# Altium schematic sheet HDMI.SchDoc
size 594 x 420 mm
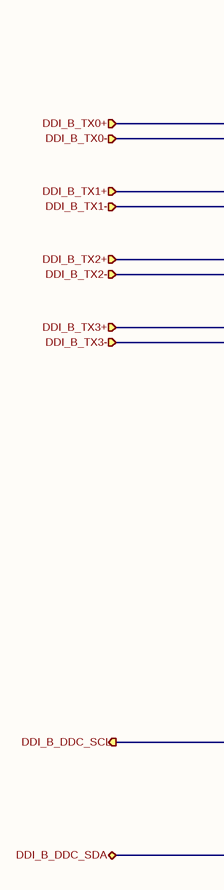
[diagram p0: HDMI.SchDoc, top left]
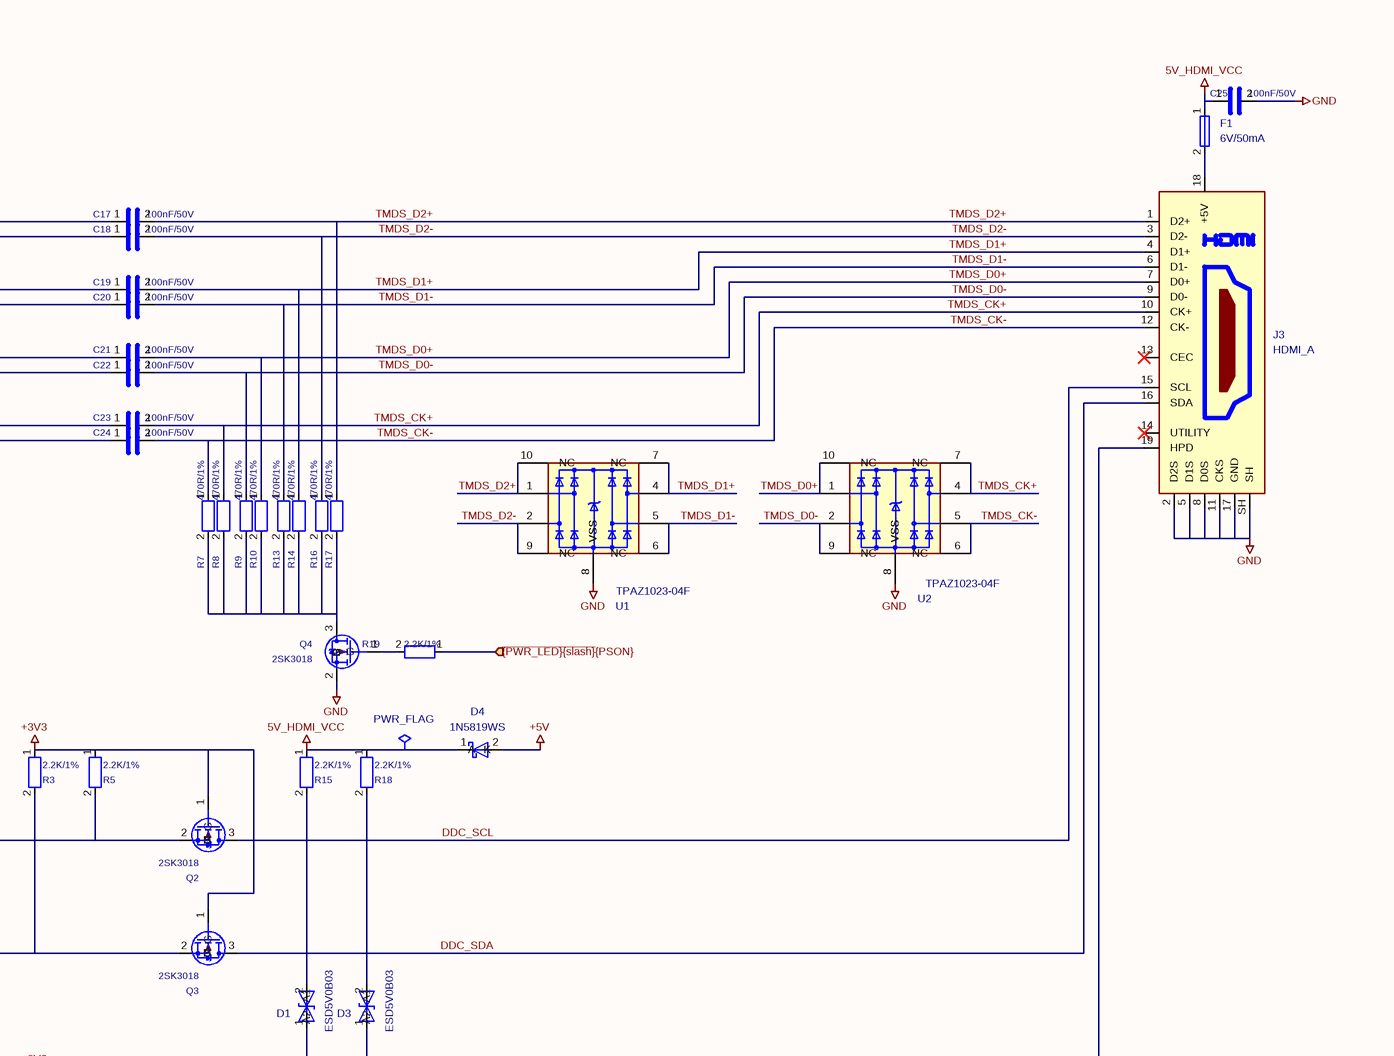
[diagram p1: HDMI.SchDoc, top right]
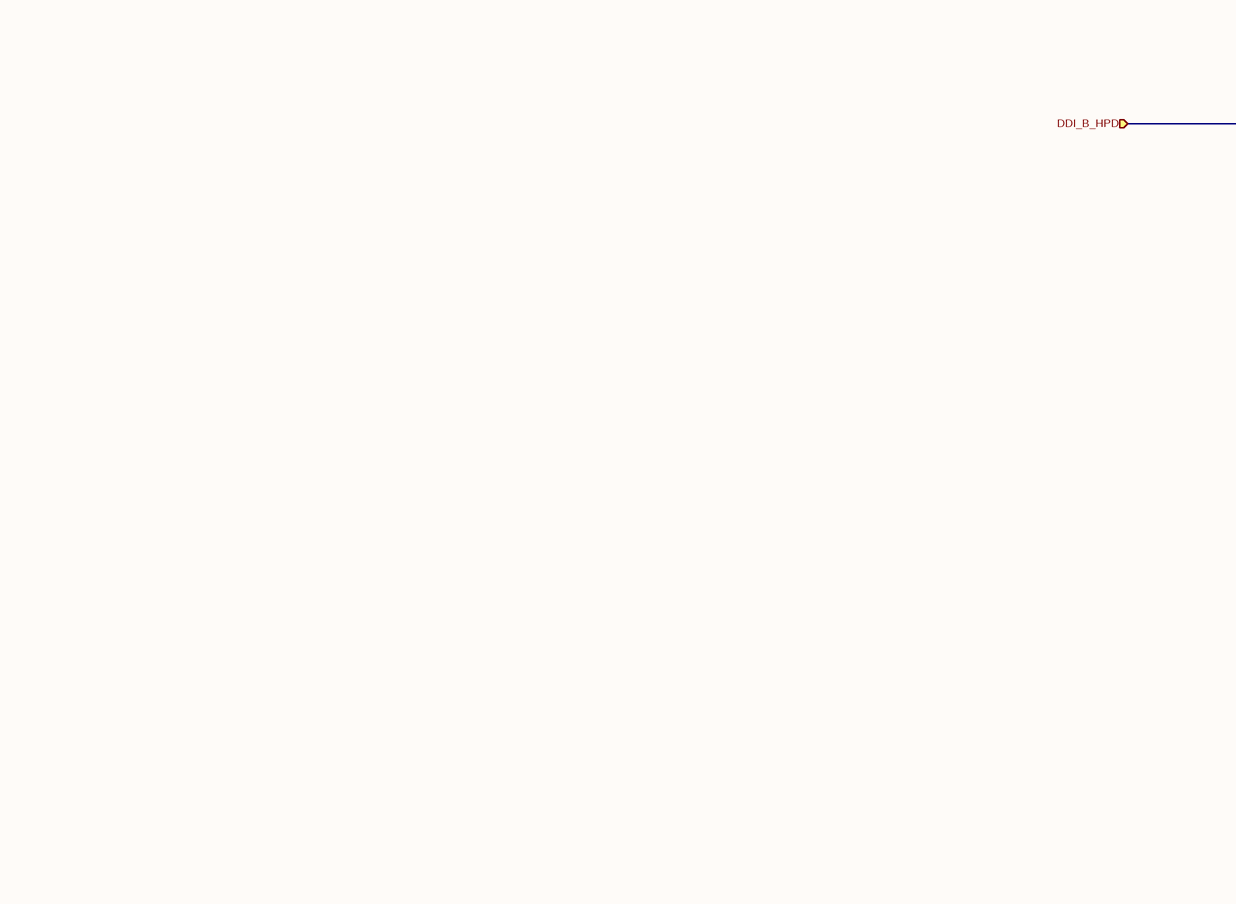
[diagram p2: HDMI.SchDoc, bottom left]
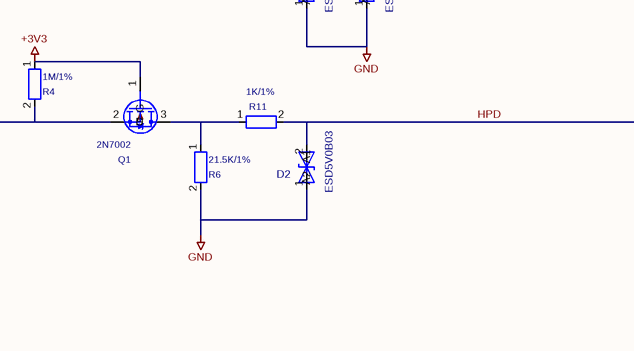
[diagram p3: HDMI.SchDoc, bottom right]

## Parts
#FLG0401  PWR_FLAG  (graphical)
C17  100nF/50V  [C_0402_1005Metric]
C18  100nF/50V  [C_0402_1005Metric]
C19  100nF/50V  [C_0402_1005Metric]
C20  100nF/50V  [C_0402_1005Metric]
C21  100nF/50V  [C_0402_1005Metric]
C22  100nF/50V  [C_0402_1005Metric]
C23  100nF/50V  [C_0402_1005Metric]
C24  100nF/50V  [C_0402_1005Metric]
C25  100nF/50V  [C_0402_1005Metric]
D1  ESD5V0B03  [D_0402_1005Metric]
D2  ESD5V0B03  [D_0402_1005Metric]
D3  ESD5V0B03  [D_0402_1005Metric]
D4  1N5819WS  [D_SOD-323]
F1  6V/50mA  [R_0603_1608Metric]
J3  HDMI_A  [HDMI_A_Molex_208658-1001_Horizontal]
Q1  2N7002  [SOT-23]
Q2  2SK3018  [SOT-23]
Q3  2SK3018  [SOT-23]
Q4  2SK3018  [SOT-23]
R3  2.2K/1%  [R_0402_1005Metric]
R4  1M/1%  [R_0402_1005Metric]
R5  2.2K/1%  [R_0402_1005Metric]
R6  21.5K/1%  [R_0402_1005Metric]
R7  470R/1%  [R_0402_1005Metric]
R8  470R/1%  [R_0402_1005Metric]
R9  470R/1%  [R_0402_1005Metric]
R10  470R/1%  [R_0402_1005Metric]
R11  1K/1%  [R_0402_1005Metric]
R13  470R/1%  [R_0402_1005Metric]
R14  470R/1%  [R_0402_1005Metric]
R15  2.2K/1%  [R_0402_1005Metric]
R16  470R/1%  [R_0402_1005Metric]
R17  470R/1%  [R_0402_1005Metric]
R18  2.2K/1%  [R_0402_1005Metric]
R19  2.2K/1%  [R_0402_1005Metric]
U1  TPAZ1023-04F  [Diodes_UDFN-10_1.0x2.5mm_P0.5mm]
U2  TPAZ1023-04F  [Diodes_UDFN-10_1.0x2.5mm_P0.5mm]

## Ports
DDI_B_DDC_SCL (out), DDI_B_DDC_SDA (bidir), DDI_B_HPD (in), DDI_B_TX0+ (in), DDI_B_TX0- (in), DDI_B_TX1+ (in), DDI_B_TX1- (in), DDI_B_TX2+ (in), DDI_B_TX2- (in), DDI_B_TX3+ (in), DDI_B_TX3- (in), ~{{PWR_LED}{slash}}{PSON} (in)

## Nets
5V_HDMI_VCC: #FLG0401.1 C25.1 D4.1(K) F1.1 R15.1 R18.1
+3V3: Q1.1(G) Q2.1(G) Q3.1(G) R3.1 R4.1 R5.1
+5V: D4.2(A)
GND: C25.2 D1.1(A1) D2.1(A1) D3.1(A1) J3.2(D2S) J3.5(D1S) J3.8(D0S) J3.11(CKS) J3.17(GND) J3.SH Q4.2(S) R6.2 U1.3(VSS) U1.8(VSS) U2.3(VSS) U2.8(VSS)
DDC_SCL: D1.2(A2) J3.15(SCL) Q2.3(D) R15.2
DDC_SDA: D3.2(A2) J3.16(SDA) Q3.3(D) R18.2
DDI_B_DDC_SCL: Q2.2(S) R5.2 ; port DDI_B_DDC_SCL
DDI_B_DDC_SDA: Q3.2(S) R3.2 ; port DDI_B_DDC_SDA
DDI_B_HPD: Q1.2(S) R4.2 ; port DDI_B_HPD
DDI_B_TX0+: C17.1 ; port DDI_B_TX0+
DDI_B_TX0-: C18.1 ; port DDI_B_TX0-
DDI_B_TX1+: C19.1 ; port DDI_B_TX1+
DDI_B_TX1-: C20.1 ; port DDI_B_TX1-
DDI_B_TX2+: C21.1 ; port DDI_B_TX2+
DDI_B_TX2-: C22.1 ; port DDI_B_TX2-
DDI_B_TX3+: C23.1 ; port DDI_B_TX3+
DDI_B_TX3-: C24.1 ; port DDI_B_TX3-
HPD: D2.2(A2) J3.19(HPD) R11.2
TMDS_CK+: C23.2 J3.10(CK+) R8.1 U2.4 U2.7(NC)
TMDS_CK-: C24.2 J3.12(CK-) R7.1 U2.5 U2.6(NC)
TMDS_D0+: C21.2 J3.7(D0+) R10.1 U2.1 U2.10(NC)
TMDS_D0-: C22.2 J3.9(D0-) R9.1 U2.2 U2.9(NC)
TMDS_D1+: C19.2 J3.4(D1+) R14.1 U1.4 U1.7(NC)
TMDS_D1-: C20.2 J3.6(D1-) R13.1 U1.5 U1.6(NC)
TMDS_D2+: C17.2 J3.1(D2+) R17.1 U1.1 U1.10(NC)
TMDS_D2-: C18.2 J3.3(D2-) R16.1 U1.2 U1.9(NC)
~{{PWR_LED}{slash}}{PSON}: R19.1 ; port ~{{PWR_LED}{slash}}{PSON}
NetF1_2: F1.2 J3.18(+5V)
NetQ1_3: Q1.3(D) R6.1 R11.1
NetQ4_1: Q4.1(G) R19.2
NetQ4_3: Q4.3(D) R7.2 R8.2 R9.2 R10.2 R13.2 R14.2 R16.2 R17.2

Not connected (* = marked no-connect by the designer): J3 13(CEC)* 14(UTILITY)*

## Notes on the sheet
- 1
- 2
- 3
- 4
- 5
- 6
- 7
- 8
- 9
- 10
- 11
- A
- B
- C
- D
- E
- F
- G
- H
- Title: Primer Carrier for LattePanda Mu
- File: HDMI.kicad_sch
- Sheet: /
- DFRobot
- KiCad E.D.A.  kicad (5.1.4)-1
- Size: A2
- Date: 2024-03-13
- Rev: V1.0.0
- Id: 1/1

## Library data of the parts
#FLG0401 = PWR_FLAG: Description: Special symbol for telling ERC where power comes from; Value: PWR_FLAG
C17-C25 = C: SCH_Show_Footprint: C0402; Value: 100nF/50V; Footprint: A_HDJ_Library:C_0402_1005Metric
D1-D3 = ESD9B5.0ST5G: SCH_Show_Footprint: D0402; Value: ESD5V0B03; Footprint: A_HDJ_Library:D_0402_1005Metric
D4 = 1N5819WS: SCH_Show_Footprint: SOD-323; Value: 1N5819WS; Footprint: A_HDJ_Library:D_SOD-323
F1 = Fuse: SCH_Show_Footprint: R0805; Value: 6V/50mA; Footprint: A_HDJ_Library:R_0603_1608Metric
Q2 = 2N7002_2: Value: 2SK3018; Footprint: A_HDJ_Library:SOT-23
Q3 = 2N7002_3: Value: 2SK3018; Footprint: A_HDJ_Library:SOT-23
Q4 = 2N7002_1: Value: 2SK3018; Footprint: A_HDJ_Library:SOT-23
R3-R11 R13-R19 = R: Footprint: A_HDJ_Library:R_0402_1005Metric
  R3 R5 R15 R18 R19: Value: 2.2K/1%
  R4: Value: 1M/1%
  R6: Value: 21.5K/1%
  R7-R10 R13 R14 R16 R17: Value: 470R/1%
  R11: Value: 1K/1%
U1 U2 = D3V3XA4B10LP: Value: TPAZ1023-04F; Footprint: A_HDJ_Library:Diodes_UDFN-10_1.0x2.5mm_P0.5mm
J3 = HDMI_A: Value: HDMI_A; Footprint: A_HDJ_Library:HDMI_A_Molex_208658-1001_Horizontal
Q1 = 2N7002: Value: 2N7002; Footprint: A_HDJ_Library:SOT-23